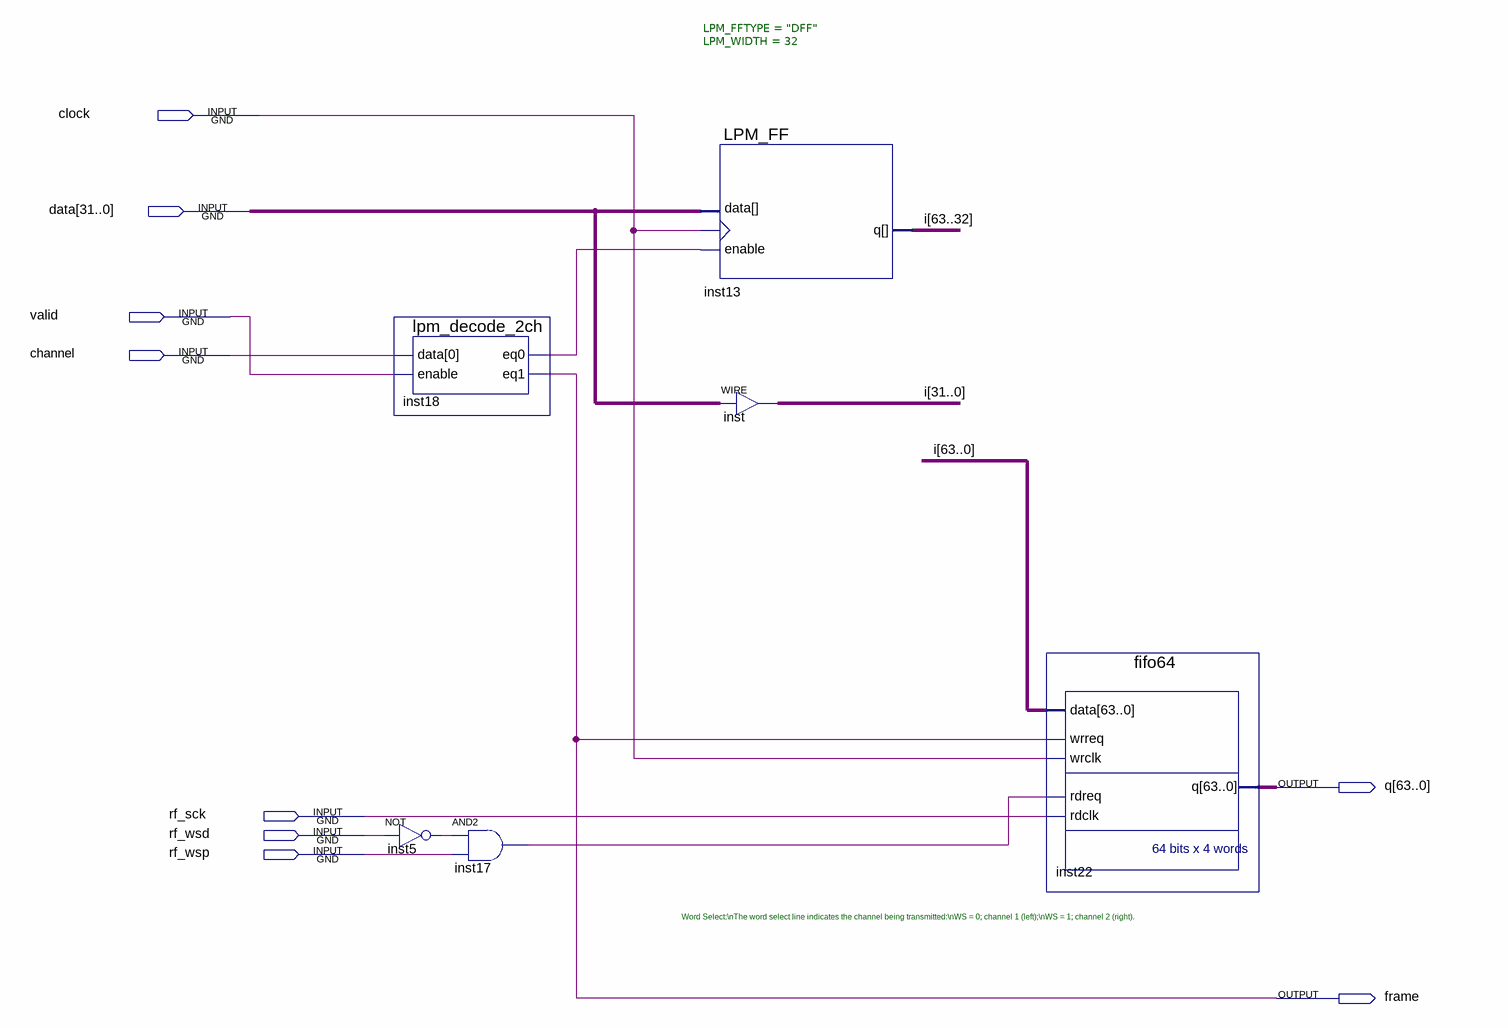
[diagram p0: schematic sheet]
// Quartus schematic avalon_to_i2s.bdf as structural Verilog: 6 symbols, 9 pins
module avalon_to_i2s (
  input  clock,
  input  [31:0] data,
  input  valid,
  input  channel,
  input  rf_sck,
  input  rf_wsd,
  input  rf_wsp,
  output [63:0] q,
  output frame
);

  wire inst5_out, inst17_out, inst18_eq0;
  wire [63:0] i;

  lpm_decode_2ch inst18 (.data(channel), .enable(valid), .eq0(inst18_eq0), .eq1(frame));
  not inst5 (inst5_out, rf_wsd);
  and inst17 (inst17_out, inst5_out, rf_wsp);
  LPM_FF #(.LPM_FFTYPE("DFF"), .LPM_WIDTH(32)) inst13 (.enable(inst18_eq0), .clock(clock), .data(data), .q(i[63:32]));
  assign i[31:0] = data;  // WIRE inst
  fifo64 inst22 (.data(i), .wrreq(frame), .wrclk(clock), .rdreq(inst17_out), .rdclk(rf_sck), .q(q));

  // Notes on the sheet:
  //   Word Select:\nThe word select line indicates the channel being transmitted:\nWS = 0; channel 1 (left);\nWS = 1; channel 2 (right).
endmodule
